# EAGLE design joyadapter (EAGLE 4.16)
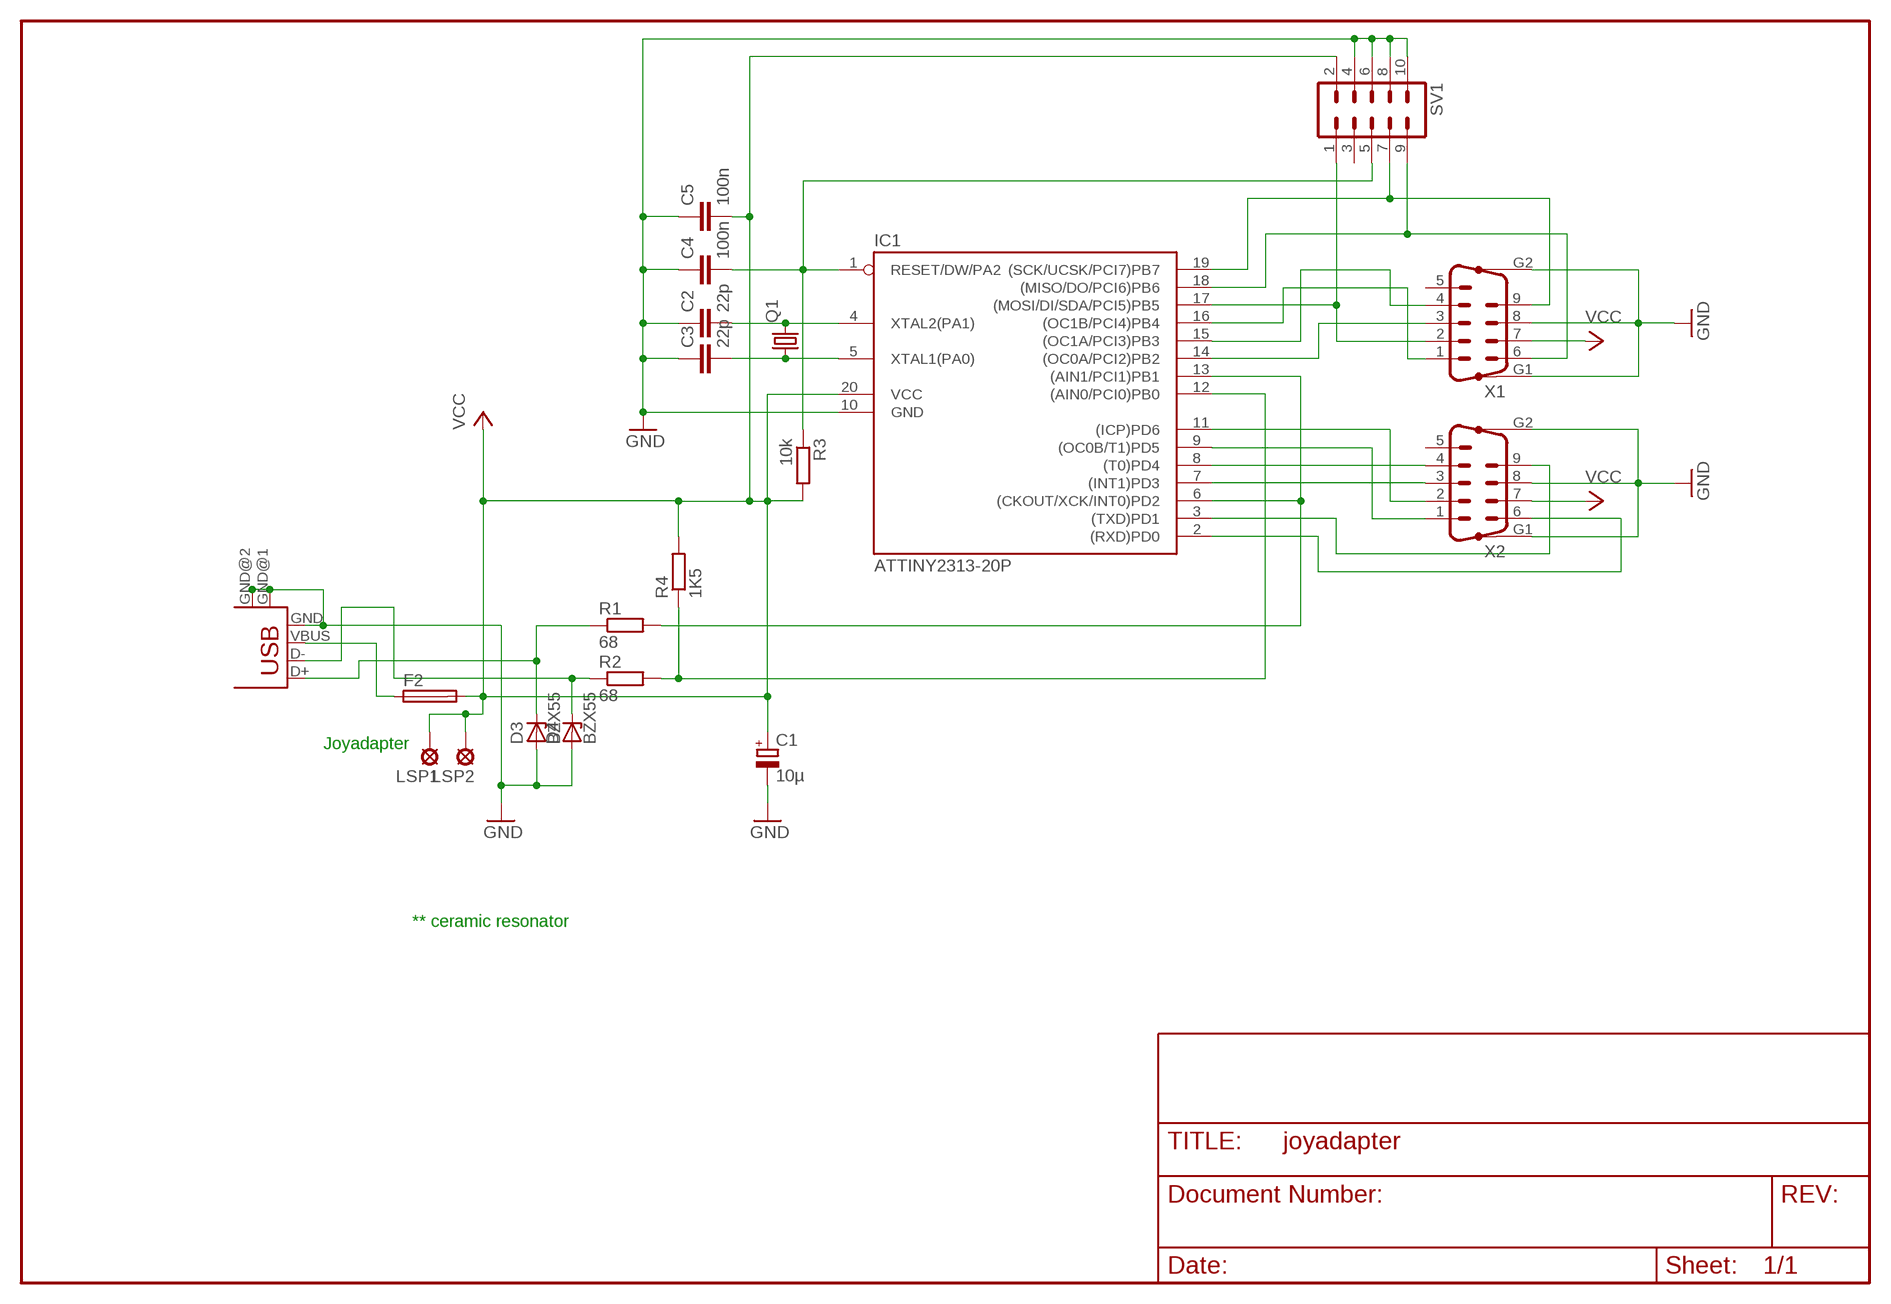
[diagram p0: schematic, sheet 1]

## Parts
C1  10µ  CPOL-EUE2-5  [E2-5]
C2  22p  C-EU025-025X050  [C025-025X050]
C3  22p  C-EU025-025X050  [C025-025X050]
C4  100n  C-EU025-025X050  [C025-025X050]
C5  100n  C-EU025-025X050  [C025-025X050]
D3  BZX55  [DO35Z10]
D4  BZX55  [DO35Z10]
F2  PICOFUSE  [PICOFUSE]
IC1  ATTINY2313-20P  [DIL20]
LSP1  LSP10  [LSP10]
LSP2  LSP10  [LSP10]
Q1  CRYSTALHC18U-V  [HC18U-V]
R1  68  R-EU_0207/10  [0207/10]
R2  68  R-EU_0207/10  [0207/10]
R3  10k  R-EU_0207/10  [0207/10]
R4  1K5  R-EU_0207/10  [0207/10]
SV1  ML10  [ML10]
USB1  USB-B-H  [USB-B-H]
X1  M09HP  [M09HP]
X2  M09HP  [M09HP]

## Nets
GND: C1.- C2.1 C3.1 C4.1 C5.1 D3.A D4.A IC1.10(GND) SV1.4 SV1.6 SV1.8 SV1.10 USB1.GND USB1.GND@1(GND) USB1.GND@2(GND) X1.8 X1.G1 X1.G2 X2.8 X2.G1 X2.G2
N$1: D4.C R2.1 USB1.D-
N$2: IC1.15((OC1A/PCI3)PB3) X1.4
N$3: D3.C R1.1 USB1.D+
N$4: IC1.12((AIN0/PCI0)PB0) R2.2 R4.1
N$5: IC1.6((CKOUT/XCK/INT0)PD2) IC1.13((AIN1/PCI1)PB1) R1.2
N$6: C2.2 IC1.4(XTAL2(PA1)) Q1.2
N$7: C3.2 IC1.5(XTAL1(PA0)) Q1.1
N$8: IC1.7((INT1)PD3) X2.3
N$9: IC1.8((T0)PD4) X2.4
N$10: IC1.9((OC0B/T1)PD5) X2.1
N$11: IC1.11((ICP)PD6) X2.2
N$12: IC1.2((RXD)PD0) X2.6
N$13: IC1.3((TXD)PD1) X2.9
N$14: IC1.14((OC0A/PCI2)PB2) X1.3
N$16: IC1.16((OC1B/PCI4)PB4) X1.1
N$17: IC1.17((MOSI/DI/SDA/PCI5)PB5) SV1.1 X1.2
N$18: IC1.18((MISO/DO/PCI6)PB6) SV1.9 X1.6
N$19: IC1.19((SCK/UCSK/PCI7)PB7) SV1.7 X1.9
N$23: C4.2 IC1.1(RESET/DW/PA2) R3.1 SV1.5
VBUS: F2.1 USB1.VBUS
VCC: C1.+ C5.2 F2.2 IC1.20(VCC) LSP1.MP LSP2.MP R3.2 R4.2 SV1.2 X1.7 X2.7
Unconnected: SV1.3 X1.5 X2.5

## Notes on the sheet
- Joyadapter
- ** ceramic resonator

## Library data of the parts
C1 = rcl:CPOL-EU: POLARIZED CAPACITOR, European symbol
C2-C5 = rcl:C-EU: CAPACITOR, European symbol
D3 D4 = diode:BZX55: Z DIODE
F2 = fuse:PICOFUSE: PICOFUSE 19275, Wickmann
IC1 = avr:ATTINY2313: MICROCONTROLLER 2 Kbytes FLASH 128 bytes SRAM 128 bytes EEPROM USART USI
LSP1 LSP2 = solpad:LSP10: SOLDER PAD drill 1.0 mm, distributor Buerklin, 12H555
Q1 = crystal:CRYSTAL: CRYSTAL
R1-R4 = rcl:R-EU_: RESISTOR, European symbol
SV1 = con-harting-ml:ML10: HARTING
USB1 = con-usb-2:USB: USB Connectors
X1 X2 = con-subd:M09HP: SUB-D

## Board
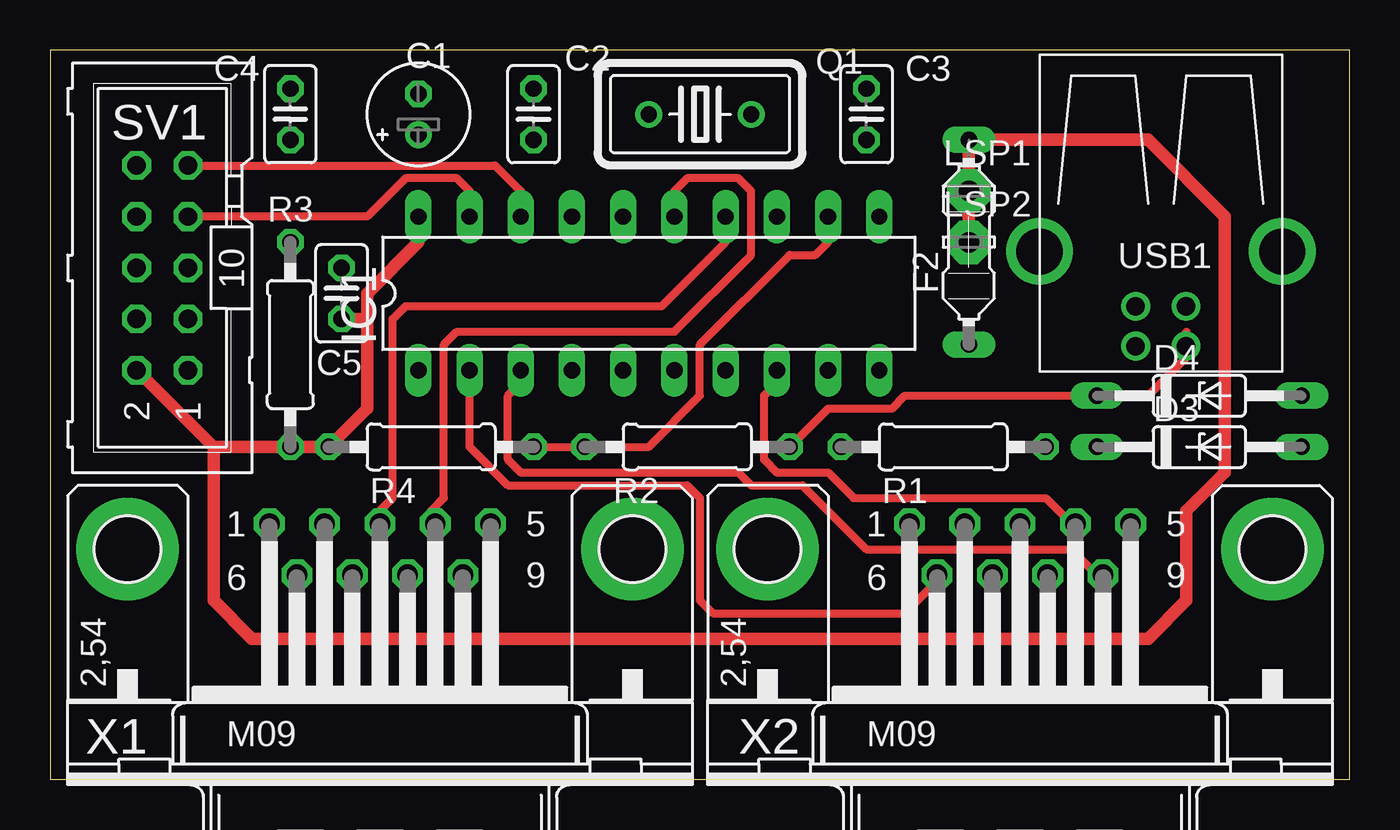
[diagram p1: board, top side]
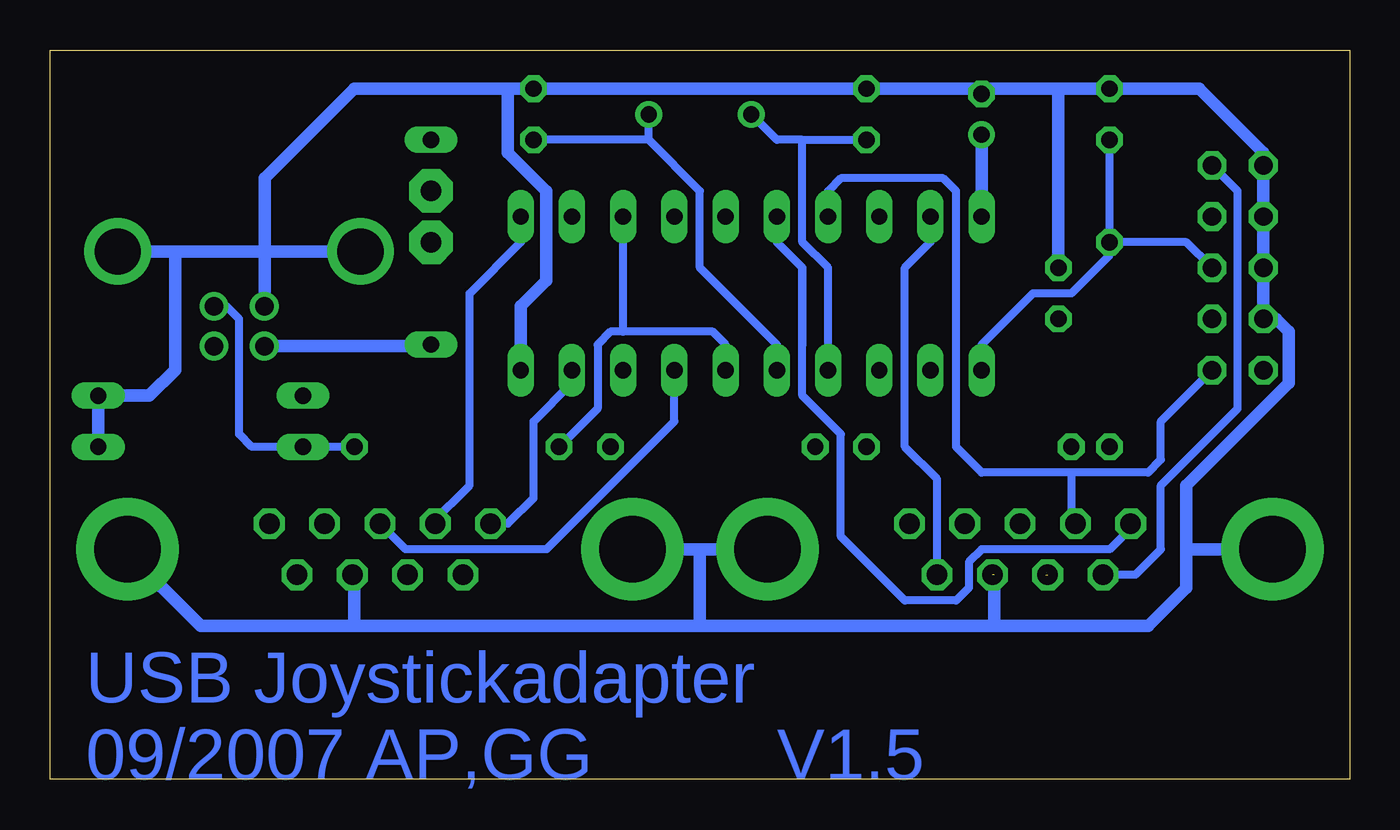
[diagram p2: board, bottom side, seen from below]

Size 64.44 x 36.19 mm. Coordinates in mm from the lower left corner, seen from the top.
Outline: 0,0 64.44,0 64.44,36.19 0,36.19 0,0
Copper layers (1*16): Top 0.035mm / dielectric 1.5mm / Bottom 0.035mm
Design rules "default": minimum track width 10mil, minimum drill 24mil, track to track 8mil, track to pad 8mil, pad to pad 8mil, via to via 8mil, smd to smd 8mil, copper to edge 40mil, drill to drill 8mil, minimum pad ring 10mil, minimum via ring 8mil, stop-mask expansion 4mil, vias tented up to drill 0mil, thermal gap 10mil

### Footprints (pad centres in the part's own frame; a part is rotated, then mirrored left to right if it is on the bottom)
E2-5 = drill 0.813 pad 1.27 round: + -1.016,0 | drill 0.813 pad 1.27 octagon: - 1.016,0
C025-025X050 = drill 0.813 octagon: 1 -1.27,0; 2 1.27,0
DO35Z10 = drill 0.813 long: A 5.08,0; C -5.08,0
PICOFUSE = drill 0.813 long: 1 -5.08,0; 2 5.08,0
DIL20 = drill 0.813 long: 1 -11.43,-3.81; 2 -8.89,-3.81; 3 -6.35,-3.81; 4 -3.81,-3.81; 5 -1.27,-3.81; 6 1.27,-3.81; 7 3.81,-3.81; 8 6.35,-3.81; 9 8.89,-3.81; 10 11.43,-3.81; 11 11.43,3.81; 12 8.89,3.81; 13 6.35,3.81; 14 3.81,3.81; 15 1.27,3.81; 16 -1.27,3.81; 17 -3.81,3.81; 18 -6.35,3.81; 19 -8.89,3.81; 20 -11.43,3.81
LSP10 = drill 1.016 pad 2.159 octagon: MP 0,0
HC18U-V = drill 0.813 round: 1 -2.54,0; 2 2.54,0
0207/10 = drill 0.813 octagon: 1 -5.08,0; 2 5.08,0
ML10 = drill 0.914 octagon: 1 -5.08,-1.27; 2 -5.08,1.27; 3 -2.54,-1.27; 4 -2.54,1.27; 5 0,-1.27; 6 0,1.27; 7 2.54,-1.27; 8 2.54,1.27; 9 5.08,-1.27; 10 5.08,1.27
USB-B-H = drill 0.914 round: D+ 0,1.25; D- 1.981,1.25; GND 0,-1.25; VBUS 1.981,-1.25 | drill 2.286 round: GND@1 -2.718,6.02; GND@2 -2.718,-6.02
M09HP = drill 1.016 octagon: 1 -5.486,1.27; 2 -2.743,1.27; 3 0,1.27; 4 2.743,1.27; 5 5.486,1.27; 6 -4.115,-1.27; 7 -1.372,-1.27; 8 1.372,-1.27; 9 4.115,-1.27 | drill 3.302 pad 5.08 round: G1 -12.522,0; G2 12.522,0

### Placement (x,y rotation side)
C1  18.25,33.02 90 top
C2  23.96,33.02 270 top
C3  40.48,33.02 270 top
C4  11.9,33.02 270 top
C5  14.44,24.12 270 top
D3  56.98,16.5 0 top
D4  56.98,19.04 0 top
F2  45.55,26.66 90 top
IC1  29.68,24.12 0 top
LSP1  45.55,29.2 0 top
LSP2  45.55,26.66 0 top
Q1  32.22,33.02 180 top
R1  44.28,16.5 180 top
R2  31.58,16.5 180 top
R3  11.9,21.59 270 top
R4  18.88,16.5 180 top
SV1  5.55,25.39 90 top
USB1  55.08,23.49 270 top
X1  16.34,11.42 0 top
X2  48.09,11.42 0 top

### Tracks (layer width: path | path; a pad name or v marks a point on that pad's centre or on a via)
GND  (1 unrouted)
  Bottom 0.61: 60.8,26.21 USB1.GND@1 | 53.81,26.21 USB1.GND@2 | 53.81,26.21 58.25,26.21 | 58.25,26.21 60.8,26.21 | 60.8,26.21 60.8,26.66 | 53.81,26.21 53.81,29.84 49.37,34.28 41.74,34.28 | 14.44,34.28 C4.1 7.46,34.28 4.28,31.11 SV1.10 SV1.8 SV1.6 SV1.4 3.64,22.86 3.01,22.22 3.01,19.68 8.09,14.6 8.09,11.42 | 14.44,34.28 18.25,34.28 C2.1 C3.1 41.74,34.28 | 8.09,11.42 8.09,9.52 10,7.62 17.61,7.62 | IC1.10 41.11,23.49 39.84,24.76 39.84,29.2 41.74,31.11 41.74,34.28 | 17.61,7.62 17.61,10.15 | X1.G1 8.09,11.42 | 32.22,11.42 X1.G2 | 32.22,11.42 X2.G1 | 17.61,7.62 32.22,7.62 | 32.22,7.62 32.22,11.42 | 32.22,7.62 49.37,7.62 | 49.37,7.62 56.98,7.62 60.8,11.42 X2.G2 60.16,11.42 | X2.8 49.37,10.15 49.37,7.62 | 58.25,26.21 58.25,20.31 59.52,19.04 D4.A D3.A | 14.44,34.28 C5.1 | USB1.GND 53.81,23.49 53.81,26.21
  Bottom 0.813: 18.25,34.28 C1.-
N$1
  Top 0.406: R2.1 38.57,18.41 41.74,18.41 42.38,19.04 D4.C 54.45,19.04 56.35,20.95 56.35,22.22 56.33,22.2 USB1.D-
N$2
  Top 0.406: IC1.15 30.95,29.2 31.58,29.84 34.12,29.84 34.76,29.2 34.76,26.03 30.95,22.22 20.15,22.22 19.52,21.59 19.52,13.96 18.88,13.33 18.88,12.7 X1.4
N$3
  Bottom 0.406: USB1.D+ 55.71,23.49 55.08,22.86 55.08,17.14 54.45,16.5 D3.C R1.1
N$4
  Top 0.406: IC1.12 38.57,26.66 37.94,26.03 36.66,26.03 32.22,21.59 32.22,19.04 29.68,16.5 R2.2 R4.1
N$5
  Bottom 0.406: IC1.6 30.95,21.59 31.58,22.22 | 31.58,22.22 36.03,22.22 IC1.13 | R1.2 37.3,18.41 37.3,21.59 36.66,22.22 31.58,22.22
N$6
  Bottom 0.406: IC1.4 25.87,25.39 27.14,26.66 27.14,31.74 | 27.14,31.74 28.41,31.74 Q1.2 | 27.14,31.74 C2.2
N$7
  Bottom 0.406: IC1.5 28.41,21.59 32.22,25.39 32.22,29.2 34.76,31.74 | 34.76,31.74 C3.2 | 34.76,31.74 Q1.1
N$8
  Bottom 0.406: IC1.7 33.49,17.77 39.84,11.42 46.82,11.42 X2.3
N$9
  Top 0.406: IC1.8 36.03,19.68 35.39,19.04 35.39,15.87 36.03,15.23 38.57,15.23 39.84,13.96 49.37,13.96 50.63,12.7 X2.4
N$10
  Bottom 0.406: X2.1 41.74,12.7 40.48,13.96 40.48,17.77 38.57,19.68 IC1.9
N$11
  Bottom 0.406: IC1.11 41.11,26.66 43.65,24.12 43.65,14.6 45.55,12.7 X2.2
N$12
  Top 0.406: IC1.2 20.79,16.5 22.7,14.6 31.58,14.6 32.22,13.96 32.22,8.88 32.85,8.25 42.38,8.25 44.28,10.15 X2.6
N$13
  Top 0.406: IC1.3 23.33,19.68 22.7,19.04 22.7,15.87 23.33,15.23 34.12,15.23 34.76,14.6 37.3,14.6 40.48,11.42 50.63,11.42 51.91,10.15 X2.9
N$14
  Top 0.406: IC1.14 33.49,26.66 30.31,23.49 17.61,23.49 16.98,22.86 16.98,13.96 16.34,13.33 X1.3
N$16
  Bottom 0.406: IC1.16 28.41,26.66 27.14,25.39 | 27.14,25.39 27.14,21.59 | 27.14,25.39 27.14,19.04 25.23,17.14 25.23,12.06 22.06,8.88 19.52,8.88 18.88,9.52 18.88,10.79 18.25,11.42 11.9,11.42 10.63,12.7 X1.1
N$17
  Bottom 0.406: IC1.17 25.87,29.2 25.23,29.84 20.15,29.84 19.52,29.2 19.52,16.5 18.25,15.23 13.81,15.23 | SV1.1 9.36,17.77 9.36,15.87 10,15.23 13.81,15.23 | X1.2 13.81,12.7 13.81,15.23
N$18
  Top 0.406: IC1.18 23.33,29.2 22.06,30.47 SV1.9
  Bottom 0.406: X1.6 10.63,10.15 9.36,11.42 9.36,14.6 5.55,18.41 5.55,29.2 SV1.9
N$19
  Top 0.406: SV1.7 15.71,27.93 17.61,29.84 20.15,29.84 20.79,29.2 IC1.19
  Bottom 0.406: X1.9 20.46,14.9 22.06,16.5 22.06,25.39 20.79,26.66 IC1.19
N$23
  Bottom 0.406: SV1.5 8.09,26.66 R3.1 | IC1.1 18.25,21.59 15.71,24.12 13.81,24.12 11.9,26.03 R3.1 | R3.1 C4.2
VBUS
  Bottom 0.61: USB1.VBUS 45.63,21.51 F2.1
VCC  (1 unrouted)
  Top 0.61: 8.09,16.5 SV1.2 | 8.09,16.5 8.09,8.88 10,6.98 15.08,6.98 | 15.08,6.98 46.82,6.98 | 46.82,6.98 54.45,6.98 56.35,8.88 56.35,13.33 58.25,15.23 58.25,27.93 54.45,31.74 F2.2 LSP1.MP LSP2.MP | IC1.20 18.25,26.66 15.71,24.12 | 8.09,16.5 R3.2 R4.2 15.71,18.41 15.71,24.12 | 15.71,24.12 15.71,22.86 C5.2 | 15.08,6.98 15.08,10.15 | X2.7 46.82,10.15 46.82,6.98
  Bottom 0.61: IC1.20 C1.+

### Text on the board
Bottom: USB Joystickadapter | V1.5 | 09/2007 AP,GG